# Altium schematic sheet 10_Speed.SchDoc
size A3; SheetNumber: 2; SheetTotal: 12
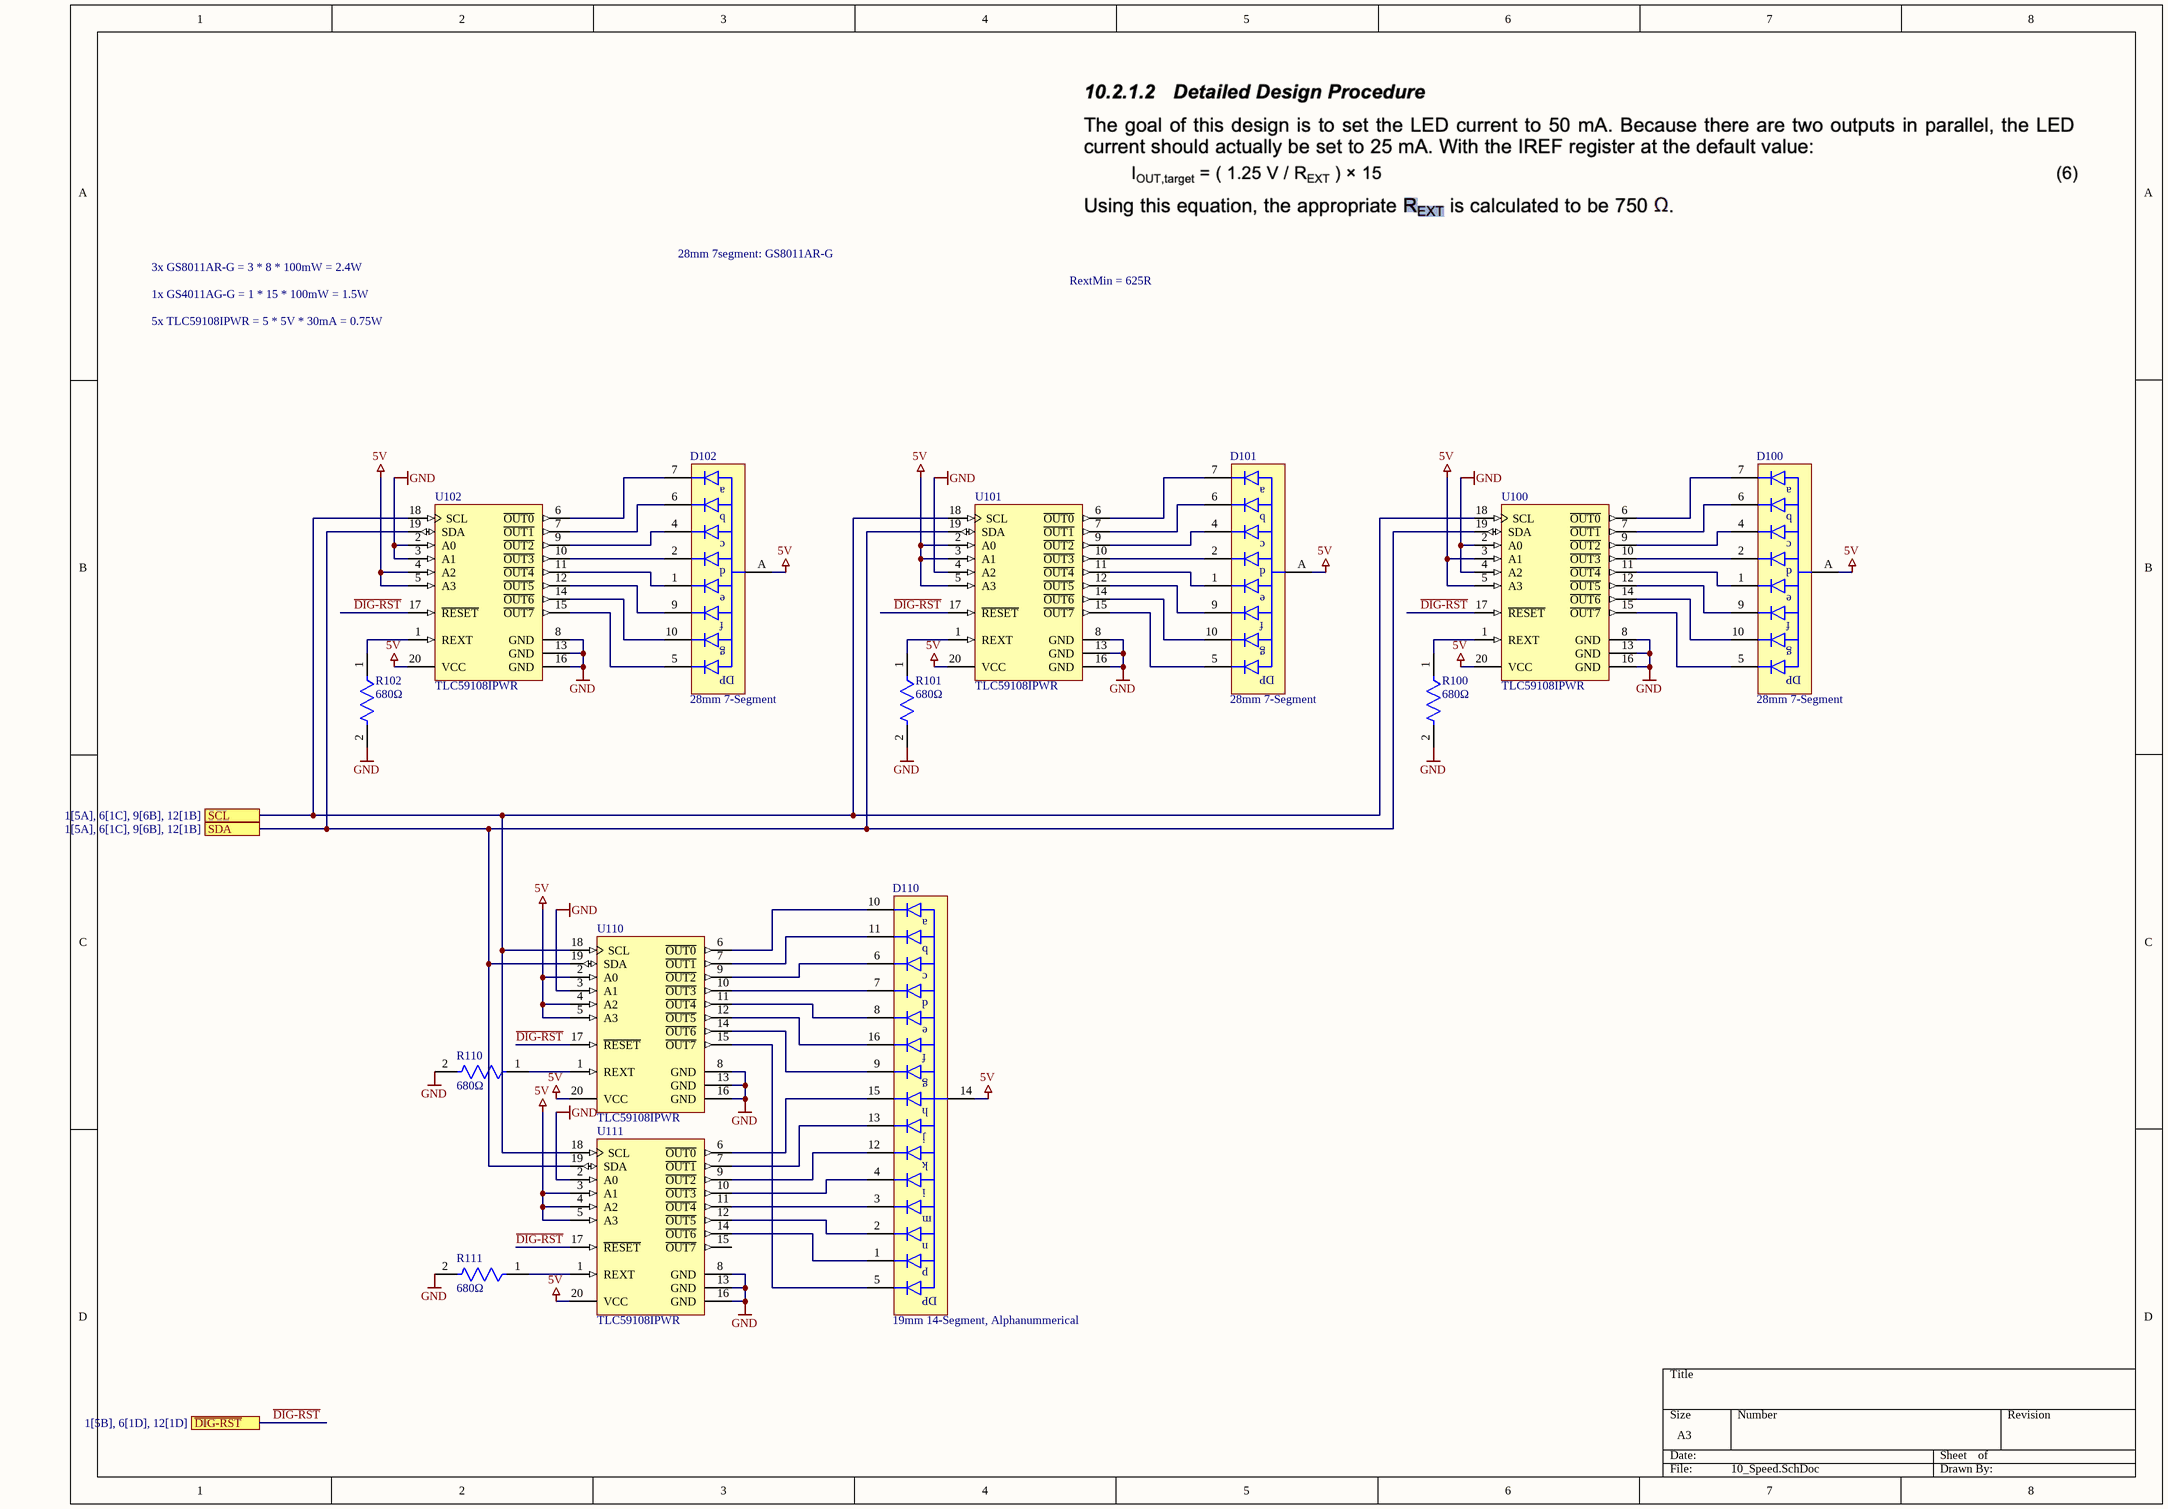
[diagram p0: 10_Speed.SchDoc]

## Parts
D100  28mm 7-Segment  [GS8011AR-G]
D101  28mm 7-Segment  [GS8011AR-G]
D102  28mm 7-Segment  [GS8011AR-G]
D110  19mm 14-Segment, Alphanummerical  [GS4011AG-G]
R100  680Ω  [FP-CRCW0603-e3-IPC_A]
R101  680Ω  [FP-CRCW0603-e3-IPC_A]
R102  680Ω  [FP-CRCW0603-e3-IPC_A]
R110  680Ω  [FP-CRCW0603-e3-IPC_A]
R111  680Ω  [FP-CRCW0603-e3-IPC_A]
U100  TLC59108IPWR  [PW0020A_M]
U101  TLC59108IPWR  [PW0020A_M]
U102  TLC59108IPWR  [PW0020A_M]
U110  TLC59108IPWR  [PW0020A_M]
U111  TLC59108IPWR  [PW0020A_M]

## Ports
SCL (see 1[5A], 6[1C], 9[6B], 12[1B]), SDA (see 1[5A], 6[1C], 9[6B], 12[1B]), ~{DIG-RST} (see 1[5B], 6[1D], 12[1D])

## Nets
5V: D100.A D101.A D102.A D110.14 U100.3(A1) U100.5(A3) U100.20(VCC) U101.2(A0) U101.3(A1) U101.5(A3) U101.20(VCC) U102.4(A2) U102.5(A3) U102.20(VCC) U110.2(A0) U110.4(A2) U110.5(A3) U110.20(VCC) U111.3(A1) U111.4(A2) U111.5(A3) U111.20(VCC)
GND: R100.2 R101.2 R102.2 R110.2 R111.2 U100.2(A0) U100.4(A2) U100.8(GND) U100.13(GND) U100.16(GND) U101.4(A2) U101.8(GND) U101.13(GND) U101.16(GND) U102.2(A0) U102.3(A1) U102.8(GND) U102.13(GND) U102.16(GND) U110.3(A1) U110.8(GND) U110.13(GND) U110.16(GND) U111.2(A0) U111.8(GND) U111.13(GND) U111.16(GND)
~{DIG-RST}: U100.17(~{RESET}) U101.17(~{RESET}) U102.17(~{RESET}) U110.17(~{RESET}) U111.17(~{RESET}) ; port ~{DIG-RST}
SCL: U100.18(SCL) U101.18(SCL) U102.18(SCL) U110.18(SCL) U111.18(SCL) ; port SCL
SDA: U100.19(SDA) U101.19(SDA) U102.19(SDA) U110.19(SDA) U111.19(SDA) ; port SDA
NetD100_1: D100.1 U100.11(~{OUT4})
NetD100_2: D100.2 U100.10(~{OUT3})
NetD100_4: D100.4 U100.9(~{OUT2})
NetD100_5: D100.5 U100.15(~{OUT7})
NetD100_6: D100.6 U100.7(~{OUT1})
NetD100_7: D100.7 U100.6(~{OUT0})
NetD100_9: D100.9 U100.12(~{OUT5})
NetD100_10: D100.10 U100.14(~{OUT6})
NetD101_1: D101.1 U101.11(~{OUT4})
NetD101_2: D101.2 U101.10(~{OUT3})
NetD101_4: D101.4 U101.9(~{OUT2})
NetD101_5: D101.5 U101.15(~{OUT7})
NetD101_6: D101.6 U101.7(~{OUT1})
NetD101_7: D101.7 U101.6(~{OUT0})
NetD101_9: D101.9 U101.12(~{OUT5})
NetD101_10: D101.10 U101.14(~{OUT6})
NetD102_1: D102.1 U102.11(~{OUT4})
NetD102_2: D102.2 U102.10(~{OUT3})
NetD102_4: D102.4 U102.9(~{OUT2})
NetD102_5: D102.5 U102.15(~{OUT7})
NetD102_6: D102.6 U102.7(~{OUT1})
NetD102_7: D102.7 U102.6(~{OUT0})
NetD102_9: D102.9 U102.12(~{OUT5})
NetD102_10: D102.10 U102.14(~{OUT6})
NetD110_1: D110.1 U111.14(~{OUT6})
NetD110_2: D110.2 U111.12(~{OUT5})
NetD110_3: D110.3 U111.11(~{OUT4})
NetD110_4: D110.4 U111.10(~{OUT3})
NetD110_5: D110.5 U110.15(~{OUT7})
NetD110_6: D110.6 U110.9(~{OUT2})
NetD110_7: D110.7 U110.10(~{OUT3})
NetD110_8: D110.8 U110.11(~{OUT4})
NetD110_9: D110.9 U110.14(~{OUT6})
NetD110_10: D110.10 U110.6(~{OUT0})
NetD110_11: D110.11 U110.7(~{OUT1})
NetD110_12: D110.12 U111.9(~{OUT2})
NetD110_13: D110.13 U111.7(~{OUT1})
NetD110_15: D110.15 U111.6(~{OUT0})
NetD110_16: D110.16 U110.12(~{OUT5})
NetR100_1: R100.1 U100.1(REXT)
NetR101_1: R101.1 U101.1(REXT)
NetR102_1: R102.1 U102.1(REXT)
NetR110_1: R110.1 U110.1(REXT)
NetR111_1: R111.1 U111.1(REXT)

Not connected (* = marked no-connect by the designer): U111 15(~{OUT7})

## Notes on the sheet
- 3x GS8011AR-G = 3 * 8 * 100mW = 2.4W
- 1x GS4011AG-G = 1 * 15 * 100mW = 1.5W
- 28mm 7segment: GS8011AR-G
- RextMin = 625R
- 5x TLC59108IPWR = 5 * 5V * 30mA = 0.75W
- (in symbol GS4011AG-G) a; b; c; d; e; f; g; h; j; k; i; m; n; p; DP
- (in symbol GS8011AR-G) a; b; c; d; e; f; g; DP

## Library data of the parts
D100-D102 = GS8011AR-G: SMD, 28x16.8mm 7-Segment
D110 = GS4011AG-G: SMD, 19x9.3mm 14-Segment, Alphanummerical
R100-R102 R110 R111 = CMP-2000-03530-2: RES Thick Film, 680Ω, 5%, 0.1W, 200ppm/°C, 0603 / CRCW0603680RJNEA; Power Rating: 100mW; Voltage Rating: 75V; Resistance: 680R; Max Operating Temperature: 155°C; Package Quantity: 1; Features: Automotive AEC-Q200; Composition: Thick Film; Length: 1.55mm; Voltage Rating (DC): 75V; Number of Terminations: 2; Termination: SMD/SMT; Case/Package: 0603; Height: 0.45mm; Min Operating Temperature: -55°C; Case Code (Imperial): 0603; Width: 0.033inch; Military Standard: Not; Max Power Dissipation: 100mW; Lead Free: Lead Free; Weight: 7.1E-05oz; Temperature Coefficient: 200ppm/°C; Contact Plating: Tin; Packaging: Tape and Reel; Radiation Hardening: No; Working Voltage: 75V; Tolerance: 5%; Number of Pins: 2; Depth: 0.85mm; Case Code (Metric): 1608
U100-U102 U110 U111 = CMP-0388-00397-2: 8-Bit Fast Mode Plus (FM+) I2C Bus Constant-Current LED Sink Driver, 3 to 5.5 V, -40 to 85 degC, 20-pin SOP (PW20), Green (RoHS & no Sb/Br); Manufacturer: Texas Instruments; Vin(Max)(V): 5.5; Vin(Min)(V): 3; Iout(Max)(A): 0.12; SubFamily: LED Driver; ComponentLink3URL: http://www.ti.com.cn/cn/lit/ml/mpds362/mpds362.pdf; PackageVersion: 4040064-5/G; ComponentLink1URL: http://www.ti.com/; ComponentLink2Description: Datasheet; ComponentLink2URL: http://www.ti.com/general/docs/lit/getliterature.tsp?genericPartNumber=TLC59108&fileType=pdf; PackageReference: PW0020A; PackageDescription: 20-Pin Plastic Small Outline, Body 6.5 x 4.4 mm, 0.65 mm Pitch; ComponentLink1Description: Manufacturer URL; ComponentLink3Description: Package Specification; Eco-Plan: Green (RoHS & no Sb/Br); PartNumber: TLC59108IPWR; Code_JEDEC: MO-153; DatasheetVersion: SLDS156A; Mounting Technology: Surface Mount